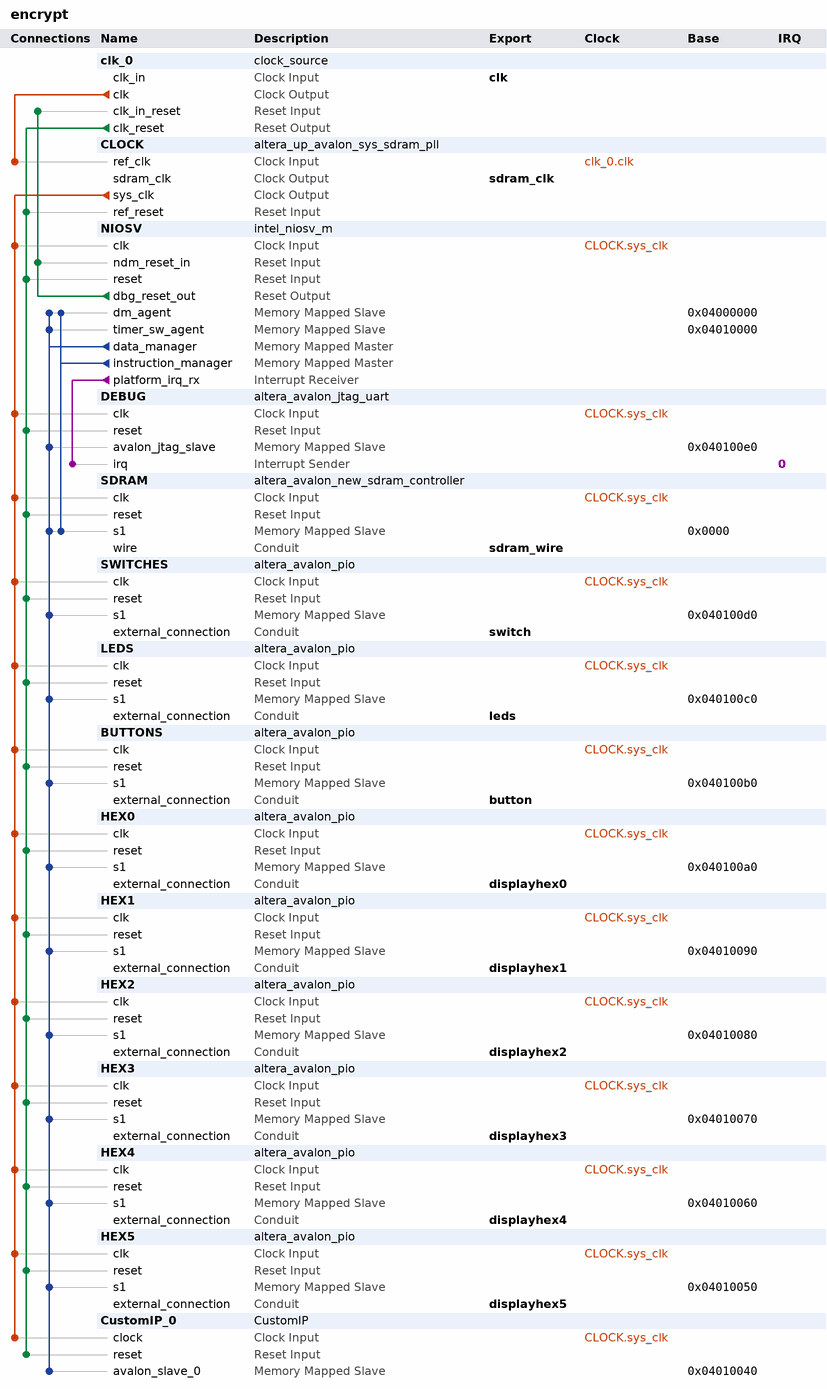
[diagram p0: system contents]
# Platform Designer (Qsys) system encrypt, Cyclone V 5CSXFC6D6F31C6
# Parameters at their usual value, and those the tool derives, are not listed.
package require -exact qsys 23.1
create_system encrypt
set_project_property DEVICE_FAMILY {Cyclone V}
set_project_property DEVICE 5CSXFC6D6F31C6

add_instance clk_0 clock_source 23.1
set_instance_parameter_value clk_0 clockFrequency 50000000

add_instance CLOCK altera_up_avalon_sys_sdram_pll 18.0
set_instance_parameter_value CLOCK CV_boards DE10-Standard
set_instance_parameter_value CLOCK gui_outclk 50.0
set_instance_parameter_value CLOCK gui_refclk 50.0

add_instance NIOSV intel_niosv_m 2.0.0
set_instance_parameter_value NIOSV enableDebugReset true
set_instance_parameter_value NIOSV enableECCLite false
set_instance_parameter_value NIOSV pipelineArch true
set_instance_parameter_value NIOSV resetSlave SDRAM.s1

add_instance DEBUG altera_avalon_jtag_uart 23.1
set_instance_parameter_value DEBUG simInteractiveOptions NO_INTERACTIVE_WINDOWS

add_instance SDRAM altera_avalon_new_sdram_controller 20.1
set_instance_parameter_value SDRAM TAC 5.4
set_instance_parameter_value SDRAM TMRD 2
set_instance_parameter_value SDRAM TRCD 15.0
set_instance_parameter_value SDRAM TRP 15.0
set_instance_parameter_value SDRAM casLatency 3
set_instance_parameter_value SDRAM columnWidth 10
set_instance_parameter_value SDRAM dataWidth 16
set_instance_parameter_value SDRAM generateSimulationModel false
set_instance_parameter_value SDRAM model single_Micron_MT48LC4M32B2_7_chip
set_instance_parameter_value SDRAM numberOfBanks 4
set_instance_parameter_value SDRAM numberOfChipSelects 1
set_instance_parameter_value SDRAM powerUpDelay 100.0
set_instance_parameter_value SDRAM refreshPeriod 7.8125
set_instance_parameter_value SDRAM rowWidth 13

add_instance SWITCHES altera_avalon_pio 23.1
set_instance_parameter_value SWITCHES direction Input
set_instance_parameter_value SWITCHES width 10

add_instance LEDS altera_avalon_pio 23.1
set_instance_parameter_value LEDS direction Output
set_instance_parameter_value LEDS width 10

add_instance BUTTONS altera_avalon_pio 23.1
set_instance_parameter_value BUTTONS direction Input
set_instance_parameter_value BUTTONS width 4

add_instance HEX0 altera_avalon_pio 23.1
set_instance_parameter_value HEX0 direction Output
set_instance_parameter_value HEX0 width 7

add_instance HEX1 altera_avalon_pio 23.1
set_instance_parameter_value HEX1 direction Output
set_instance_parameter_value HEX1 width 7

add_instance HEX2 altera_avalon_pio 23.1
set_instance_parameter_value HEX2 direction Output
set_instance_parameter_value HEX2 width 7

add_instance HEX3 altera_avalon_pio 23.1
set_instance_parameter_value HEX3 direction Output
set_instance_parameter_value HEX3 width 7

add_instance HEX4 altera_avalon_pio 23.1
set_instance_parameter_value HEX4 direction Output
set_instance_parameter_value HEX4 width 7

add_instance HEX5 altera_avalon_pio 23.1
set_instance_parameter_value HEX5 direction Output
set_instance_parameter_value HEX5 width 7

add_instance CustomIP_0 CustomIP 1.0

# connections
add_connection clk_0.clk CLOCK.ref_clk clock
add_connection CLOCK.sys_clk BUTTONS.clk clock
add_connection CLOCK.sys_clk CustomIP_0.clock clock
add_connection CLOCK.sys_clk DEBUG.clk clock
add_connection CLOCK.sys_clk HEX0.clk clock
add_connection CLOCK.sys_clk HEX1.clk clock
add_connection CLOCK.sys_clk HEX2.clk clock
add_connection CLOCK.sys_clk HEX3.clk clock
add_connection CLOCK.sys_clk HEX4.clk clock
add_connection CLOCK.sys_clk HEX5.clk clock
add_connection CLOCK.sys_clk LEDS.clk clock
add_connection CLOCK.sys_clk NIOSV.clk clock
add_connection CLOCK.sys_clk SDRAM.clk clock
add_connection CLOCK.sys_clk SWITCHES.clk clock
add_connection clk_0.clk_reset BUTTONS.reset reset
add_connection clk_0.clk_reset CLOCK.ref_reset reset
add_connection clk_0.clk_reset CustomIP_0.reset reset
add_connection clk_0.clk_reset DEBUG.reset reset
add_connection clk_0.clk_reset HEX0.reset reset
add_connection clk_0.clk_reset HEX1.reset reset
add_connection clk_0.clk_reset HEX2.reset reset
add_connection clk_0.clk_reset HEX3.reset reset
add_connection clk_0.clk_reset HEX4.reset reset
add_connection clk_0.clk_reset HEX5.reset reset
add_connection clk_0.clk_reset LEDS.reset reset
add_connection clk_0.clk_reset NIOSV.reset reset
add_connection clk_0.clk_reset SDRAM.reset reset
add_connection clk_0.clk_reset SWITCHES.reset reset
add_connection NIOSV.dbg_reset_out clk_0.clk_in_reset reset
add_connection NIOSV.dbg_reset_out NIOSV.ndm_reset_in reset
add_connection NIOSV.data_manager BUTTONS.s1 avalon
set_connection_parameter_value NIOSV.data_manager/BUTTONS.s1 baseAddress 0x040100b0
add_connection NIOSV.data_manager CustomIP_0.avalon_slave_0 avalon
set_connection_parameter_value NIOSV.data_manager/CustomIP_0.avalon_slave_0 baseAddress 0x04010040
add_connection NIOSV.data_manager DEBUG.avalon_jtag_slave avalon
set_connection_parameter_value NIOSV.data_manager/DEBUG.avalon_jtag_slave baseAddress 0x040100e0
add_connection NIOSV.data_manager HEX0.s1 avalon
set_connection_parameter_value NIOSV.data_manager/HEX0.s1 baseAddress 0x040100a0
add_connection NIOSV.data_manager HEX1.s1 avalon
set_connection_parameter_value NIOSV.data_manager/HEX1.s1 baseAddress 0x04010090
add_connection NIOSV.data_manager HEX2.s1 avalon
set_connection_parameter_value NIOSV.data_manager/HEX2.s1 baseAddress 0x04010080
add_connection NIOSV.data_manager HEX3.s1 avalon
set_connection_parameter_value NIOSV.data_manager/HEX3.s1 baseAddress 0x04010070
add_connection NIOSV.data_manager HEX4.s1 avalon
set_connection_parameter_value NIOSV.data_manager/HEX4.s1 baseAddress 0x04010060
add_connection NIOSV.data_manager HEX5.s1 avalon
set_connection_parameter_value NIOSV.data_manager/HEX5.s1 baseAddress 0x04010050
add_connection NIOSV.data_manager LEDS.s1 avalon
set_connection_parameter_value NIOSV.data_manager/LEDS.s1 baseAddress 0x040100c0
add_connection NIOSV.data_manager NIOSV.dm_agent avalon
set_connection_parameter_value NIOSV.data_manager/NIOSV.dm_agent baseAddress 0x04000000
add_connection NIOSV.data_manager NIOSV.timer_sw_agent avalon
set_connection_parameter_value NIOSV.data_manager/NIOSV.timer_sw_agent baseAddress 0x04010000
add_connection NIOSV.data_manager SDRAM.s1 avalon
set_connection_parameter_value NIOSV.data_manager/SDRAM.s1 baseAddress 0x0000
add_connection NIOSV.data_manager SWITCHES.s1 avalon
set_connection_parameter_value NIOSV.data_manager/SWITCHES.s1 baseAddress 0x040100d0
add_connection NIOSV.instruction_manager NIOSV.dm_agent avalon
set_connection_parameter_value NIOSV.instruction_manager/NIOSV.dm_agent baseAddress 0x04000000
add_connection NIOSV.instruction_manager SDRAM.s1 avalon
set_connection_parameter_value NIOSV.instruction_manager/SDRAM.s1 baseAddress 0x0000
add_connection NIOSV.platform_irq_rx DEBUG.irq interrupt
set_connection_parameter_value NIOSV.platform_irq_rx/DEBUG.irq irqNumber 0

# exported interfaces
add_interface button conduit end
set_interface_property button EXPORT_OF BUTTONS.external_connection
add_interface clk clock sink
set_interface_property clk EXPORT_OF clk_0.clk_in
add_interface displayhex0 conduit end
set_interface_property displayhex0 EXPORT_OF HEX0.external_connection
add_interface displayhex1 conduit end
set_interface_property displayhex1 EXPORT_OF HEX1.external_connection
add_interface displayhex2 conduit end
set_interface_property displayhex2 EXPORT_OF HEX2.external_connection
add_interface displayhex3 conduit end
set_interface_property displayhex3 EXPORT_OF HEX3.external_connection
add_interface displayhex4 conduit end
set_interface_property displayhex4 EXPORT_OF HEX4.external_connection
add_interface displayhex5 conduit end
set_interface_property displayhex5 EXPORT_OF HEX5.external_connection
add_interface leds conduit end
set_interface_property leds EXPORT_OF LEDS.external_connection
add_interface sdram_clk clock source
set_interface_property sdram_clk EXPORT_OF CLOCK.sdram_clk
add_interface sdram_wire conduit end
set_interface_property sdram_wire EXPORT_OF SDRAM.wire
add_interface switch conduit end
set_interface_property switch EXPORT_OF SWITCHES.external_connection

set_interconnect_requirement {$system} qsys_mm.clockCrossingAdapter HANDSHAKE
set_interconnect_requirement {$system} qsys_mm.enableEccProtection FALSE
set_interconnect_requirement {$system} qsys_mm.insertDefaultSlave FALSE
set_interconnect_requirement {$system} qsys_mm.maxAdditionalLatency 1

save_system encrypt.qsys
